# Altium schematic sheet Power.SchDoc
size A
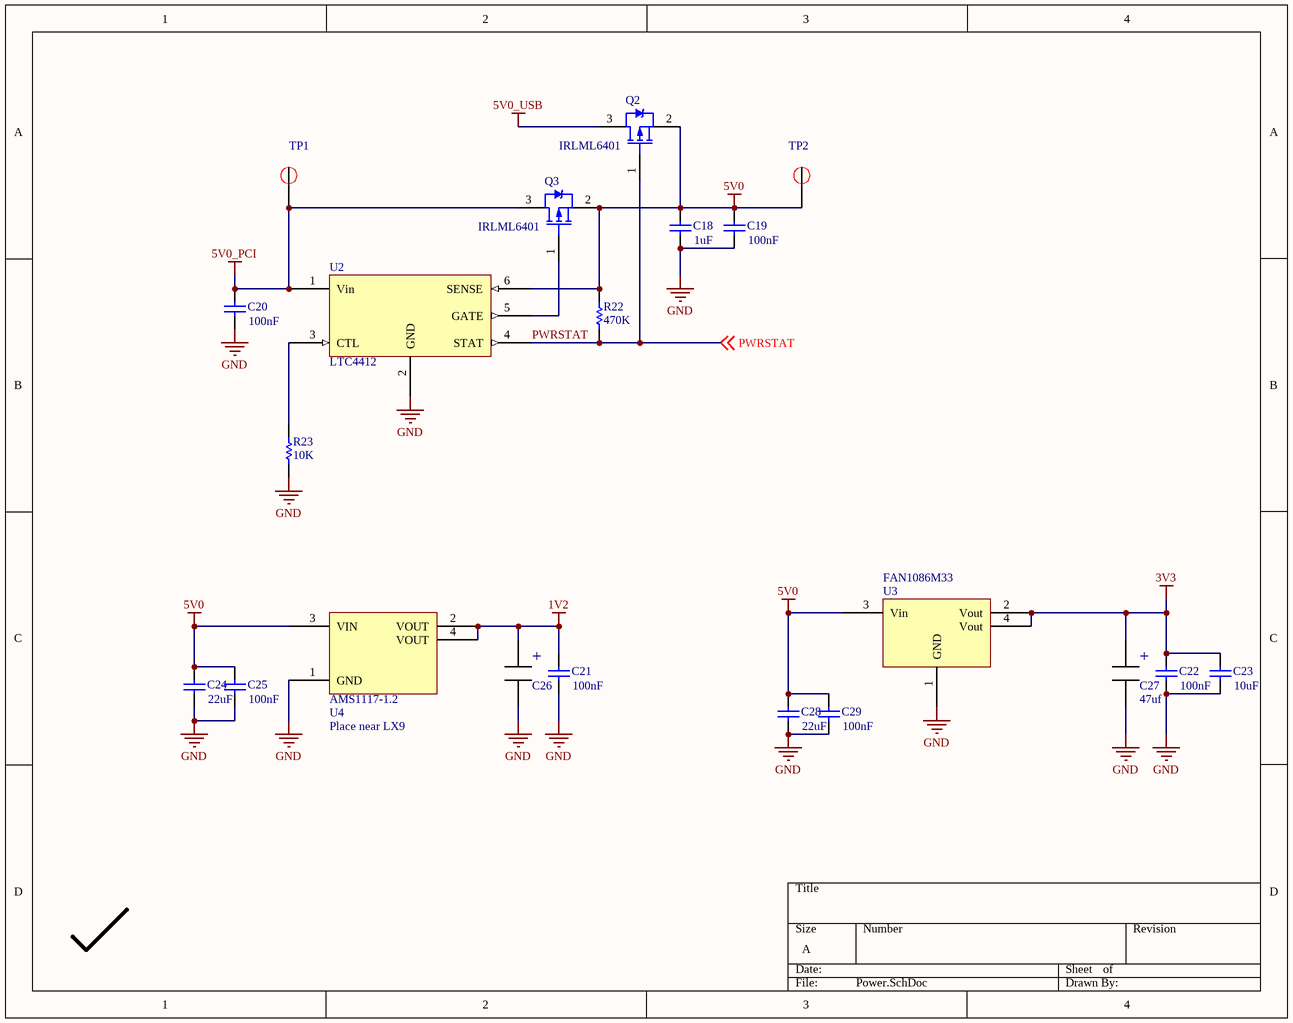
[diagram p0: Power.SchDoc]

## Parts
C18  value 1uF  [0603PKG]  (hidden comment: Cap)
C19  value 100nF  [0603PKG]  (hidden comment: Cap)
C20  value 100nF  [0603PKG]  (hidden comment: Cap)
C21  value 100nF  [C0805]  (hidden comment: Cap)
C22  value 100nF  [C0805]  (hidden comment: Cap)
C23  value 10uF  [C0805]  (hidden comment: Cap)
C24  value 22uF  [C1206]  (hidden comment: Cap)
C25  value 100nF  [C0805]  (hidden comment: Cap)
C26  Capacitor  [Capacitor]  (value not drawn)
C27  value 47uf  [Capacitor]  (hidden comment: Capacitor)
C28  value 22uF  [C1206]  (hidden comment: Cap)
C29  value 100nF  [C0805]  (hidden comment: Cap)
Q2  IRLML6401  [SOT23]
Q3  IRLML6401  [SOT23]
R22  value 470K  [0603PKG]  (hidden comment: Res Semi)
R23  value 10K  [0603PKG]  (hidden comment: Res Semi)
TP1  TP  [TP_15]  (value not drawn)
TP2  TP  [TP_15]  (value not drawn)
U2  LTC4412  [SOT23-6]
U3  FAN1086M33  [TO263]
U4  AMS1117-1.2  [SOT223]

## Nets
1V2: C21.2 C26.2 U4.2(VOUT) U4.4(VOUT)
3V3: C22.2 C23.2 C27.2 U3.2(Vout) U3.4(Vout)
5V0: C18.2 C19.2 C24.2 C25.2 C28.2 C29.2 Q2.2(S) Q3.2(S) R22.2 TP2.1 U2.6(SENSE) U3.3(Vin) U4.3(VIN)
5V0_PCI: C20.2 Q3.3(D) TP1.1 U2.1(Vin)
5V0_USB: Q2.3(D)
GND: C18.1 C19.1 C20.1 C21.1 C22.1 C23.1 C24.1 C25.1 C26.1 C27.1 C28.1 C29.1 R23.1 U2.2(GND) U3.1(GND) U4.1(GND)
PWRSTAT: Q2.1(G) R22.1 U2.4(STAT) ; off-sheet PWRSTAT
NetQ3_1: Q3.1(G) U2.5(GATE)
NetR23_2: R23.2 U2.3(CTL)

## Notes on the sheet
- (near U4) Place near LX9
- (in symbol SMS capacitor) +

## Library data of the parts
C18-C25 C28 C29 = Cap: Capacitor; Published: 8-Jun-2000; LatestRevisionDate: 17-Jul-2002; LatestRevisionNote: Re-released for DXP Platform.; PackageReference: RAD-0.3; Publisher: Altium Limited; PackageDescription: Radial Cap, Thru-Hole; 2 Leads; 0.3 in Pin Spacing
C26 = SMS capacitor: Value: 47uf
C27 = SMS capacitor
Q2 Q3 = PMOS-2: P-Channel Power MOSFET; Note: Pin 4 not drawn and electrically connected to Pin 2.; Published: 8-Jun-2000; LatestRevisionDate: 17-Jul-2002; LatestRevisionNote: Re-released for DXP Platform.; DatasheetVersion: PD-9.390D; PackageVersion: Feb-1997; PackageReference: TO-220AB; Publisher: Altium Limited; PackageDescription: TO, Thru-Hole, Vertical, Heatsink Mounted; 3 In-Line Leads; Pitch 2.54 mm; ComponentLink1Description: Manufacturer Link; ComponentLink1URL: http://www.irf.com/
R22 R23 = Res Semi: Semiconductor Resistor; Published: 8-Jun-2000; LatestRevisionDate: 17-Jul-2002; LatestRevisionNote: Re-released for DXP Platform.; PackageReference: AXIAL-0.5; Publisher: Altium Limited; PackageDescription: Axial Device, Thru-Hole; 2 Leads; 0.5 in Pin Spacing
TP1 TP2 = Test Point
U2 = LTC4412: Low Loss PowerPath™  Controller in ThinSOT
U4 = AMS1117-1.2: 1A Adjustable/Fixed Low Dropout Linear Regulator